# Altium schematic sheet Communication, connectors & headers.SchDoc
size A
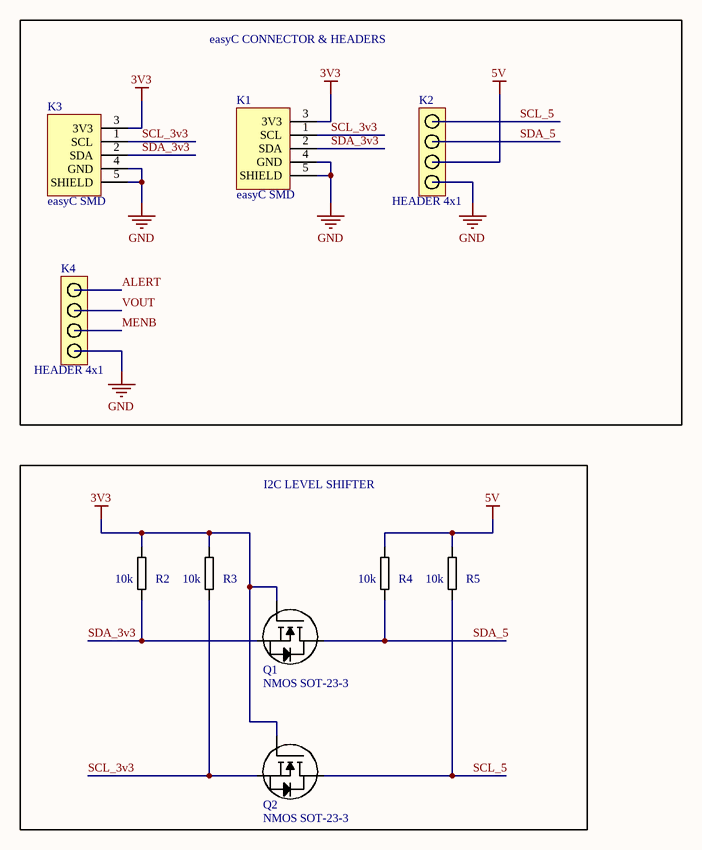
[diagram p0: Communication, connectors & headers.SchDoc]

## Parts
K1  easyC SMD  [EasyC connector]
K2  HEADER 4x1  [HEADER MALE 4x1]
K3  easyC SMD  [EasyC connector]
K4  HEADER 4x1  [HEADER MALE 4x1]
Q1  NMOS SOT-23-3  [SOT-23-3]
Q2  NMOS SOT-23-3  [SOT-23-3]
R2  10k  [0603R]
R3  10k  [0603R]
R4  10k  [0603R]
R5  10k  [0603R]

## Blocks framed on the sheet
easyC CONNECTOR & HEADERS: K1-K4
I2C LEVEL SHIFTER: Q1 Q2 R2-R5

## Nets
3V3: K1.3(3V3) K3.3(3V3) Q1.1(G) Q2.1(G) R2.2 R3.2
5V: K2.3 R4.2 R5.2
GND: K1.4(GND) K1.5(SHIELD) K2.4 K3.4(GND) K3.5(SHIELD) K4.4
ALERT: K4.1
MENB: K4.3
SCL_3v3: K1.1(SCL) K3.1(SCL) Q2.2(S) R3.1
SCL_5: K2.1 Q2.3(D) R5.1
SDA_3v3: K1.2(SDA) K3.2(SDA) Q1.2(S) R2.1
SDA_5: K2.2 Q1.3(D) R4.1
VOUT: K4.2

## Library data of the parts
R2-R5 = 0603R
Q1 Q2 = NMOS SOT-23-3: Supplier 1: Mouser; Supplier 2: Arrow; Supplier 3: Digi-Key; Supplier Part Number 1: 522-ZXMN2A14FTA; Supplier Part Number 2: ZXMN2A14FTA; Supplier Part Number 3: ZXMN2A14FCT-ND